# Altium project FlightController.PrjPcb
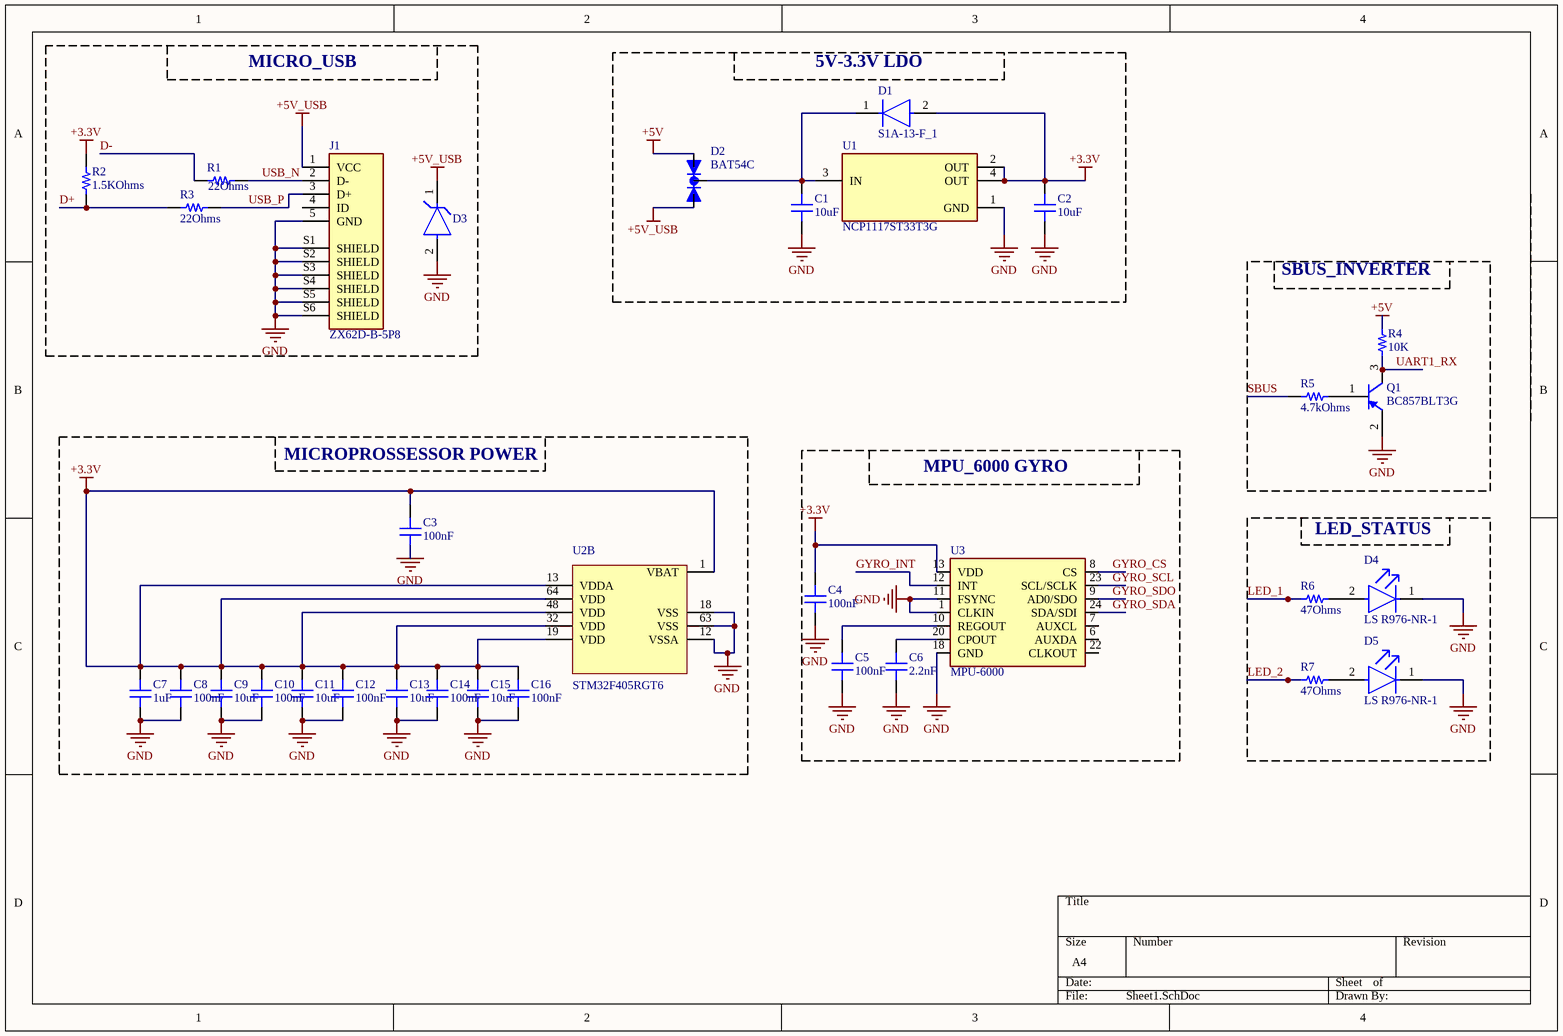
[diagram p0: Sheet1.SchDoc]
3 sheets, 45 parts. Net scope: global (net labels, ports and power ports of the same name join across sheets).
Board file: PCB1.PcbDoc
Sheets:
  Sheet1.SchDoc
  Sheet2.SchDoc
  blockdiagram.SchDoc

## Sheet Sheet1.SchDoc
size A4

### Parts
C1  10uF  [CAP-0603]
C2  10uF  [CAP-0603]
C3  100nF  [CAP-0603]
C4  100nF  [CAP-0603]
C5  100nF  [CAP-0603]
C6  2.2nF  [CAP-0603]
C7  1uF  [CAP-0603]
C8  100nF  [CAP-0603]
C9  10uF  [CAP-0603]
C10  100nF  [CAP-0603]
C11  10uF  [CAP-0603]
C12  100nF  [CAP-0603]
C13  10uF  [CAP-0603]
C14  100nF  [CAP-0603]
C15  10uF  [CAP-0603]
C16  100nF  [CAP-0603]
D1  S1A-13-F_1  [S1A-13-F]
D2  BAT54C  [SOT23-3]
D3  ESDA7P60-1U1M  [TVS-1610]  (value not drawn)
D4  LS R976-NR-1  [LS R976-NR-1]
D5  LS R976-NR-1  [LS R976-NR-1]
J1  ZX62D-B-5P8  [HRS_ZX62D-B-5P8]
Q1  BC857BLT3G  [SOT23-3]
R1  22Ohms  [RES-0603]
R2  1.5KOhms  [RES-0603]
R3  22Ohms  [RES-0603]
R4  10K  [RES-0603]
R5  4.7kOhms  [RES-0603]
R6  47Ohms  [RES-0603]
R7  47Ohms  [RES-0603]
U1  NCP1117ST33T3G  [SOT-223-4]
U2  STM32F405RGT6  [STMicroelectronics_LQFP64-5W_MFG]  (part B of 2)
U3  MPU-6000  [QFN-24-EP]

### Blocks framed on the sheet
MICRO_USB: D3 J1 R1-R3
5V-3.3V LDO: C1 C2 D1 D2 U1
SBUS_INVERTER: Q1 R4 R5
MICROPROSSESSOR POWER: C3 C7-C16 U2
MPU_6000 GYRO: C4-C6 U3
LED_STATUS: D4 D5 R6 R7

### Nets
+3.3V: C2.2 C3.2 C4.2 C7.2 C8.2 C9.2 C10.2 C11.2 C12.2 C13.2 C14.2 C15.2 C16.2 D1.2(A) R2.2 U1.2(OUT) U1.4(OUT) U2.1(VBAT) U2.13(VDDA) U2.19(VDD) U2.32(VDD) U2.48(VDD) U2.64(VDD) U3.13(VDD)
+5V: D2.1(A1) R4.2
+5V_USB: D2.2(A2) D3.1(C) J1.1(VCC)
GND: C1.1 C2.1 C3.1 C4.1 C5.2 C6.1 C7.1 C8.1 C9.1 C10.1 C11.1 C12.1 C13.1 C14.1 C15.1 C16.1 D3.2(A) D4.1(C) D5.1(C) J1.5(GND) J1.S1(SHIELD) J1.S2(SHIELD) J1.S3(SHIELD) J1.S4(SHIELD) J1.S5(SHIELD) J1.S6(SHIELD) Q1.2(E) U1.1(GND) U2.12(VSSA) U2.18(VSS) U2.63(VSS) U3.1(CLKIN) U3.11(FSYNC) U3.18(GND)
D+: R2.1 R3.1
D-: R1.1
GYRO_CS: U3.8(CS)
GYRO_INT: U3.12(INT)
GYRO_SCL: U3.23(SCL/SCLK)
GYRO_SDA: U3.24(SDA/SDI)
GYRO_SDO: U3.9(AD0/SDO)
LED_1: R6.2
LED_2: R7.2
SBUS: R5.1
UART1_RX: Q1.3(C) R4.1
USB_N: J1.2(D-) R1.2
USB_P: J1.3(D+) R3.2
NetC1_2: C1.2 D1.1(C) D2.3(C) U1.3(IN)
NetC5_1: C5.1 U3.10(REGOUT)
NetC6_2: C6.2 U3.20(CPOUT)
NetD4_2: D4.2(A) R6.1
NetD5_2: D5.2(A) R7.1
NetQ1_1: Q1.1(B) R5.2

Not connected (* = marked no-connect by the designer): J1 4(ID); U3 6(AUXDA) 7(AUXCL) 22(CLKOUT)

### Library data of the parts
C1 C2 C9 C11 C13 C15 = CC0603MRX5R7BB106: 10 µF ±20% 16V Ceramic Capacitor X5R 0603 (1608 Metric); Manufacturer: KEMET; Manufacturer Part Number: C0603C104K5RAC7411; Tolerance: 10%; Capacitance: 100nF; Dielectric: X7R; Voltage Rating (DC): 50V; Dissipation Factor: 2.5%; Supplier 1: Digi-Key; RoHS: Yes; Category: Ceramic Capacitors; Stock 1: 3300000; Pricing 1: 15000=0,01540, 30000=0,01463, 75000=0,01309, 105000=0,01059, 150000=0,01024, 375000=0,00963 (USD); Mount: Surface Mount; Case/Package: 0603; Case Code (Metric): 1608; Case Code (Imperial): 0603; Dielectric Material: Ceramic; Min Operating Temperature: -55°C; Max Operating Temperature: 125°C; Packaging: Tape and Reel; Package Quantity: 15000; Voltage Rating: 50V; Termination: SMD/SMT; Length: 1.6mm; Width: 0.031inch; Height: 0.8mm; Thickness: 0.035inch; Lead Pitch: 0.7mm; Depth: 0.8mm; Radiation Hardening: No; ComponentLink1URL: https://datasheet.ciiva.com/5424/kem-c1002-x7r-smd-5424426.pdf?src-supplier=Mouser; ComponentLink1Description: https://datasheet.ciiva.com/5424/kem-c1002-x7r-smd-5424426.pdf?src-supplier=Mouser; Supplier Part Number 1: 399-7374-2-ND; Supplier 2: Digi-Key; Stock 2: 3575; Pricing 2: 1=0,45000, 10=0,31500, 50=0,22080, 100=0,18930, 500=0,14194, 1000=0,11986 (USD); Weight: 7.1E-05oz; Lead Free: Lead Free; Halogen Free: Halogen Free; RoHS Compliant: Yes; ComponentLink2URL: http://www.mouser.com/ds/2/447/Yageo_UPY-GP_NP0_16V-to-50V_9-358835.pdf?src-supplier=Mouser; ComponentLink2Description: http://www.mouser.com/ds/2/447/Yageo_UPY-GP_NP0_16V-to-50V_9-358835.pdf?src-supplier=Mouser; ComponentLink3URL: http://www.yageo.com/documents/recent/UPY-GPHC_X5R_4V-to-50V_25.pdf?src-supplier=Digi-Key; ComponentLink3Description: http://www.yageo.com/documents/recent/UPY-GPHC_X5R_4V-to-50V_25.pdf?src-supplier=Digi-Key; Supplier Part Number 2: 311-1822-1-ND
C3-C5 C8 C10 C12 C14 C16 = C0603C104K5RAC7411: Cap Ceramic 0.1uF 50V X7R 10% SMD 0603 125°C Paper T/R 100nF; Manufacturer: KEMET; Dissipation Factor: 2.5%; Supplier 1: Digi-Key; Manufacturer Part Number: C0603C104K5RAC7411; RoHS: Yes; Category: Ceramic Capacitors; Stock 1: 3300000; Pricing 1: 15000=0,01540, 30000=0,01463, 75000=0,01309, 105000=0,01059, 150000=0,01024, 375000=0,00963 (USD); Mount: Surface Mount; Case/Package: 0603; Case Code (Metric): 1608; Case Code (Imperial): 0603; Dielectric Material: Ceramic; Min Operating Temperature: -55°C; Max Operating Temperature: 125°C; Tolerance: 10%; Capacitance: 100nF; Dielectric: X7R; Voltage Rating (DC): 50V; Packaging: Tape and Reel; Package Quantity: 15000; Voltage Rating: 50V; Termination: SMD/SMT; Length: 1.6mm; Width: 0.031inch; Height: 0.8mm; Thickness: 0.035inch; Lead Pitch: 0.7mm; Depth: 0.8mm; Radiation Hardening: No; ComponentLink1URL: https://datasheet.ciiva.com/5424/kem-c1002-x7r-smd-5424426.pdf?src-supplier=Mouser; ComponentLink1Description: https://datasheet.ciiva.com/5424/kem-c1002-x7r-smd-5424426.pdf?src-supplier=Mouser; Supplier Part Number 1: 399-7374-2-ND
C6 = 0603YC222KAT2A: 2200 pF ±10% 16V Ceramic Capacitor X7R 0603 (1608 Metric) 2.2nF; Manufacturer: KEMET; Manufacturer Part Number: C0603C104K5RAC7411; Capacitance: 100nF; Voltage Rating (DC): 50V; Dissipation Factor: 2.5%; Supplier 1: Digi-Key; RoHS: Yes; Category: Ceramic Capacitors; Stock 1: 3300000; Pricing 1: 15000=0,01540, 30000=0,01463, 75000=0,01309, 105000=0,01059, 150000=0,01024, 375000=0,00963 (USD); Mount: Surface Mount; Case/Package: 0603; Case Code (Metric): 1608; Case Code (Imperial): 0603; Dielectric Material: Ceramic; Min Operating Temperature: -55°C; Max Operating Temperature: 125°C; Tolerance: 10%; Dielectric: X7R; Packaging: Tape and Reel; Package Quantity: 15000; Voltage Rating: 50V; Termination: SMD/SMT; Length: 1.6mm; Width: 0.031inch; Height: 0.8mm; Thickness: 0.035inch; Lead Pitch: 0.7mm; Depth: 0.8mm; Radiation Hardening: No; ComponentLink1URL: https://datasheet.ciiva.com/5424/kem-c1002-x7r-smd-5424426.pdf?src-supplier=Mouser; ComponentLink1Description: https://datasheet.ciiva.com/5424/kem-c1002-x7r-smd-5424426.pdf?src-supplier=Mouser; Supplier Part Number 1: 399-7374-2-ND; Supplier 2: Digi-Key; Stock 2: 82908; Pricing 2: 1=0,10000, 10=0,06500, 50=0,03560, 100=0,02910, 500=0,02080, 1000=0,01634 (USD); Number of Pins: 2; Contact Plating: Tin,Matte; Series: -; Construction: Flat; REACH SVHC: No SVHC; Lead Free: Lead Free; RoHS Compliant: Yes; ComponentLink2URL: https://datasheet.ciiva.com/150/cx7r-150288.pdf?src-supplier=Digi-Key; ComponentLink2Description: https://datasheet.ciiva.com/150/cx7r-150288.pdf?src-supplier=Digi-Key; ComponentLink3URL: https://datasheet.ciiva.com/150/cx7r-150289.pdf?src-supplier=Digi-Key; ComponentLink3Description: https://datasheet.ciiva.com/150/cx7r-150289.pdf?src-supplier=Digi-Key; ComponentLink4URL: https://datasheet.ciiva.com/5412/cx7r-218113-5412506.pdf?src-supplier=Mouser; ComponentLink4Description: https://datasheet.ciiva.com/5412/cx7r-218113-5412506.pdf?src-supplier=Mouser; ComponentLink5URL: https://datasheet.ciiva.com/22682/1679506-22682859.pdf?src-supplier=Element14; ComponentLink5Description: https://datasheet.ciiva.com/22682/1679506-22682859.pdf?src-supplier=Element14; ComponentLink6URL: https://datasheet.ciiva.com/28546/1679506-28546235.pdf?src-supplier=Element14; ComponentLink6Description: https://datasheet.ciiva.com/28546/1679506-28546235.pdf?src-supplier=Element14; ComponentLink7URL: https://datasheet.ciiva.com/16199/cx7r-16199340.pdf?src-supplier=Future+Electronics; ComponentLink7Description: https://datasheet.ciiva.com/16199/cx7r-16199340.pdf?src-supplier=Future+Electronics; ComponentLink8URL: https://datasheet.ciiva.com/150/cx7r-150287.pdf?src-supplier=Digi-Key; ComponentLink8Description: https://datasheet.ciiva.com/150/cx7r-150287.pdf?src-supplier=Digi-Key; Supplier Part Number 2: 478-6210-1-ND
C7 = CC0603MRX5R7BB105: Cap Ceramic 1uF 16V X5R 20% Pad SMD 0603 85C Automotive T/R; Manufacturer: KEMET; Manufacturer Part Number: C0603C104K5RAC7411; Tolerance: 10%; Capacitance: 100nF; Dielectric: X7R; Voltage Rating (DC): 50V; Dissipation Factor: 2.5%; Supplier 1: Digi-Key; RoHS: Yes; Category: Ceramic Capacitors; Stock 1: 3300000; Pricing 1: 15000=0,01540, 30000=0,01463, 75000=0,01309, 105000=0,01059, 150000=0,01024, 375000=0,00963 (USD); Mount: Surface Mount; Case/Package: 0603; Case Code (Metric): 1608; Case Code (Imperial): 0603; Dielectric Material: Ceramic; Min Operating Temperature: -55°C; Max Operating Temperature: 125°C; Packaging: Tape and Reel; Package Quantity: 15000; Voltage Rating: 50V; Termination: SMD/SMT; Length: 1.6mm; Width: 0.031inch; Height: 0.8mm; Thickness: 0.035inch; Lead Pitch: 0.7mm; Depth: 0.8mm; Radiation Hardening: No; ComponentLink1URL: https://datasheet.ciiva.com/5424/kem-c1002-x7r-smd-5424426.pdf?src-supplier=Mouser; ComponentLink1Description: https://datasheet.ciiva.com/5424/kem-c1002-x7r-smd-5424426.pdf?src-supplier=Mouser; Supplier Part Number 1: 399-7374-2-ND; Supplier 2: Digi-Key; Stock 2: 3575; Pricing 2: 1=0,45000, 10=0,31500, 50=0,22080, 100=0,18930, 500=0,14194, 1000=0,11986 (USD); Weight: 7.1E-05oz; Lead Free: Lead Free; Halogen Free: Halogen Free; RoHS Compliant: Yes; ComponentLink2URL: http://www.mouser.com/ds/2/447/Yageo_UPY-GP_NP0_16V-to-50V_9-358835.pdf?src-supplier=Mouser; ComponentLink2Description: http://www.mouser.com/ds/2/447/Yageo_UPY-GP_NP0_16V-to-50V_9-358835.pdf?src-supplier=Mouser; ComponentLink3URL: http://www.yageo.com/documents/recent/UPY-GPHC_X5R_4V-to-50V_25.pdf?src-supplier=Digi-Key; ComponentLink3Description: http://www.yageo.com/documents/recent/UPY-GPHC_X5R_4V-to-50V_25.pdf?src-supplier=Digi-Key; Supplier Part Number 2: 311-1822-1-ND; Supplier 3: Digi-Key; Stock 3: 9457; Pricing 3: 1=0,11000, 10=0,08000, 50=0,04560, 100=0,03780, 500=0,02648, 1000=0,02191 (USD); Resistor Type: Ceramic; Series: CC; ComponentLink4URL: http://www.mouser.com/ds/2/447/UPY-GPHC_X5R_4V-to-50V_25-1131599.pdf?src-supplier=Mouser; ComponentLink4Description: http://www.mouser.com/ds/2/447/UPY-GPHC_X5R_4V-to-50V_25-1131599.pdf?src-supplier=Mouser; ComponentLink5URL: http://www.yageo.com/exep/pages/download/literatures/ProductSelectionGuide%202014_Final_2.pdf?src-supplier=Digi-Key; ComponentLink5Description: http://www.yageo.com/exep/pages/download/literatures/ProductSelectionGuide%202014_Final_2.pdf?src-supplier=Digi-Key; Supplier Part Number 3: 311-1821-1-ND
D1 = S1A-13-F_1: VR=50V IF=1A 10pF Trr=3us; Manufacturer: Diodes; Forward Current: 1A; Max Repetitive Reverse Voltage (Vrrm): 50V; Element Configuration: Single; Reverse Recovery Time: 3us; Peak Non-Repetitive Surge Current: 30A; Max Reverse Current: 5uA; Forward Voltage: 1.1V; Recovery Time: 1.8us; Polarity: Standard; Supplier 1: Digi-Key; Manufacturer Part Number: S1A-13-F; RoHS: Yes; Category: Rectifier Diodes; Stock 1: 971381; Pricing 1: 1=0,27000, 10=0,22300, 100=0,11850, 500=0,07796, 1000=0,05301, 2000=0,04782 (USD); Mount: Surface Mount; Case/Package: SMA; Number of Pins: 2; Weight: 0.002258oz; Min Operating Temperature: -65°C; Max Operating Temperature: 150°C; Packaging: Tape and Reel; Package Quantity: 5000; Max Surge Current: 30A; Reverse Voltage (DC): 50V; Average Rectified Current: 1A; Voltage Rating (DC): 50V; Current Rating: 1A; Capacitance: 10pF; Output Current: 1A; Max Reverse Voltage (DC): 50V; Series: -; Max Forward Surge Current (Ifsm): 30A; Termination: SMD/SMT; Length: 4.6mm; Width: 2.92mm; Height: 2.1mm; Radiation Hardening: No; Lead Free: Lead Free; RoHS Compliant: Yes; REACH SVHC: No SVHC; ComponentLink1URL: https://datasheet.ciiva.com/911/ds16003-911872.pdf?src-supplier=Digi-Key; ComponentLink1Description: https://datasheet.ciiva.com/911/ds16003-911872.pdf?src-supplier=Digi-Key; ComponentLink2URL: https://datasheet.ciiva.com/27052/1541520-27052419.pdf?src-supplier=Jameco; ComponentLink2Description: https://datasheet.ciiva.com/27052/1541520-27052419.pdf?src-supplier=Jameco; ComponentLink3URL: https://datasheet.ciiva.com/8301/ds16003-8301429.pdf?src-supplier=Avnet; ComponentLink3Description: https://datasheet.ciiva.com/8301/ds16003-8301429.pdf?src-supplier=Avnet; ComponentLink4URL: https://datasheet.ciiva.com/22695/1911706-22695830.pdf?src-supplier=Element14; ComponentLink4Description: https://datasheet.ciiva.com/22695/1911706-22695830.pdf?src-supplier=Element14; ComponentLink5URL: https://datasheet.ciiva.com/4453/ds16003-83672-4453580.pdf?src-supplier=Mouser; ComponentLink5Description: https://datasheet.ciiva.com/4453/ds16003-83672-4453580.pdf?src-supplier=Mouser; ComponentLink6URL: https://datasheet.ciiva.com/16199/ds16003-16199336.pdf?src-supplier=Future+Electronics; ComponentLink6Description: https://datasheet.ciiva.com/16199/ds16003-16199336.pdf?src-supplier=Future+Electronics; ComponentLink7URL: https://datasheet.ciiva.com/25953/ds16003-25953033.pdf?src-supplier=Avnet+Europe; ComponentLink7Description: https://datasheet.ciiva.com/25953/ds16003-25953033.pdf?src-supplier=Avnet+Europe; Supplier Part Number 1: S1A-FDICT-ND
D2 = BAT54C: Diode Array 1 Pair Common Cathode Schottky 30V 200mA Surface Mount TO-236-3, SC-59, SOT-23-3; MF: ON Semiconductor; Package: SOT-23-3 ON Semiconductor; Value: *; SnapEDA_Link: https://www.snapeda.com/parts/BAT54C/ON%20Semiconductor/view-part/1985258/?ref=snap; Availability: Unavailable; Price: None; MP: BAT54C
D3 = ESDA7P60-1U1M: ESDA Series 6.4 V 700 W SMT Uni-Directional TVS Diode - 1610; Manufacturer: STMicroelectronics; Number of Unidirectional Channels: 1; Reverse Standoff Voltage: 5V; Min Breakdown Voltage: 6.4V; Clamping Voltage: 11.6V; Peak Pulse Power: 700W; Power Line Protection: No; Polarity: Unidirectional; Max Breakdown Voltage: 7.2V; Peak Pulse Current: 60A; Supplier 1: Digi-Key; Manufacturer Part Number: ESDA7P60-1U1M; RoHS: Yes; Category: TVS Diodes; Stock 1: 12994; Pricing 1: 1=0,51000, 10=0,38400, 100=0,23910, 500=0,16360, 1000=0,12584, 2000=0,11326 (USD); Mount: Surface Mount; Case/Package: 1610; Number of Pins: 2; Min Operating Temperature: -55°C; Max Operating Temperature: 150°C; Packaging: Cut Tape; Resistor Type: Zener; REACH SVHC: No SVHC; RoHS Compliant: Yes; ComponentLink1URL: http://www.farnell.com/datasheets/2041290.pdf?src-supplier=Farnell; ComponentLink1Description: http://www.farnell.com/datasheets/2041290.pdf?src-supplier=Farnell; ComponentLink2URL: http://www.st.com/content/ccc/resource/technical/document/datasheet/44/e9/26/44/42/ee/4f/e5/DM00139972.pdf/files/DM00139972.pdf/jcr:content/translations/en.DM00139972.pdf?src-supplier=Digi-Key; ComponentLink2Description: http://www.st.com/content/ccc/resource/technical/document/datasheet/44/e9/26/44/42/ee/4f/e5/DM00139972.pdf/files/DM00139972.pdf/jcr:content/translations/en.DM00139972.pdf?src-supplier=Digi-Key; ComponentLink3URL: http://www.farnell.com/datasheets/2041290.pdf?src-supplier=Element14; ComponentLink3Description: http://www.farnell.com/datasheets/2041290.pdf?src-supplier=Element14; Supplier Part Number 1: 497-16253-1-ND
D4 D5 = LS R976-NR-1: Led SMT Red 0805 Tape; Manufacturer: Osram Opto; Lens Color: White; Forward Current: 25mA; Forward Voltage: 2.5V; Luminous Intensity: 180mcd; Viewing Angle: 160°; Lens Style: Flat,Diffused,Colorless,Rectangular; Test Current: 20mA; Dominant Wavelength: 633nm; Luminous Flux: 0.47lm; Number of Elements: 1; Reverse Voltage: 12V; Power Dissipation: 65mW; Lens Transparency: Diffused; Lens Size: 1.25mm; Supplier 1: Digi-Key; Manufacturer Part Number: LSR976-NR-1; RoHS: Yes; Category: LEDs; Stock 1: 165904; Pricing 1: 1=0,31000, 10=0,16700, 100=0,07750, 500=0,07152, 1000=0,05602, 2000=0,05483 (USD); Mount: Surface Mount; Case/Package: 0805; Number of Pins: 2; Color: Red; Case Code (Metric): 2012; Case Code (Imperial): 0805; Min Operating Temperature: -30°C; Max Operating Temperature: 85°C; Packaging: Tape and Reel; Number of LEDs: 1; Illumination Color: Red; Package Quantity: 16000; Series: CHIPLED 0805; Length: 2.1mm; Width: 1.25mm; Height: 0.9mm; Depth: 1.35mm; Radiation Hardening: No; RoHS Compliant: Yes; ComponentLink1URL: https://datasheet.ciiva.com/4688/o-ls-ly-r976-24152-4688435.pdf?src-supplier=Mouser; ComponentLink1Description: https://datasheet.ciiva.com/4688/o-ls-ly-r976-24152-4688435.pdf?src-supplier=Mouser; ComponentLink2URL: https://datasheet.ciiva.com/26920/getdatasheetpartid-568367-26920831.pdf?src-supplier=Verical; ComponentLink2Description: https://datasheet.ciiva.com/26920/getdatasheetpartid-568367-26920831.pdf?src-supplier=Verical; ComponentLink3URL: https://datasheet.ciiva.com/2112/00078896-0-2112782.pdf?src-supplier=Digi-Key; ComponentLink3Description: https://datasheet.ciiva.com/2112/00078896-0-2112782.pdf?src-supplier=Digi-Key; ComponentLink4URL: https://datasheet.ciiva.com/2112/00078896-0-2112781.pdf?src-supplier=Digi-Key; ComponentLink4Description: https://datasheet.ciiva.com/2112/00078896-0-2112781.pdf?src-supplier=Digi-Key; ComponentLink5URL: https://datasheet.ciiva.com/2112/00078896-0-2112783.pdf?src-supplier=Digi-Key; ComponentLink5Description: https://datasheet.ciiva.com/2112/00078896-0-2112783.pdf?src-supplier=Digi-Key; Supplier Part Number 1: 475-1278-1-ND
J1 = ZX62D-B-5P8: Conn Micro USB 2.0 Type B RCP 5 POS 0.65mm Solder RA SMD 5 Terminal 1 Port Embossed T/R; MF: Hirose; Value: *; Availability: Unavailable; SnapEDA_Link: https://www.snapeda.com/parts/ZX62D-B-5P8/Hirose%20Electric%20Co%20Ltd/view-part/46842/?ref=snap; Package: FakePackage u; MP: ZX62D-B-5P8; Price: None
Q1 = BC857BLT3G: General Purpose Transistor, PNP Silicon, 3-Pin SOT-23, Pb-Free, Tape and Reel; Manufacturer: On Semiconductor; fT Min (MHz): 100; IC Continuous (A): -0.1; Polarity: PNP; ComponentLink1Description: Manufacturer URL; ComponentLink2Description: Datasheet; DatasheetVersion: Rev. 13; Mounting Technology: Surface Mount; ComponentLink3URL: http://www.onsemi.cn/pub_link/Collateral/318-08.PDF; ComponentLink3Description: Package Specification; ComponentLink1URL: http://www.onsemi.com/; Packing: Tape and Reel; PackageVersion: Rev. AP, 11/2009; PartNumber: BC857BLT3G; PackageDescription: 3-Pin Small Outline Transistor, Body 2.92 x 1.3 mm, Pitch 0.95 mm; ComponentLink2URL: http://www.onsemi.cn/pub_link/Collateral/BC856ALT1-D.PDF; RoHS: TRUE; PackageReference: SOT-23-3-318-08
R1 R3 = RC0603JR-0722RL: 22 Ohms ±5% 0.1W, 1/10W Chip Resistor 0603 (1608 Metric) Moisture Resistant Thick Film; Manufacturer: Yageo; Manufacturer Part Number: RC0402JR-071K2L; Resistance: 1.2kR; Power Rating: 62.5mW; Voltage Rating: 50V; Temperature Coefficient: 100ppm/°C; Max Power Dissipation: 63mW; RoHS: Yes; Category: Chip SMD Resistors; Stock 1: 52843; Pricing 1: 1=0,10000, 10=0,01300, 100=0,00540, 1000=0,00244, 2500=0,00212, 5000=0,00175 (USD); Case/Package: 0402; Case Code (Imperial): 0402; Case Code (Metric): 1005; Size Code: 0402; Min Operating Temperature: -55°C; Max Operating Temperature: 155°C; Tolerance: 5%; Packaging: Tape and Reel; Termination: SMD/SMT; Resistor Type: Thick Film; Features: Moisture Resistant; Series: RC; Number of Terminations: 2; Resistance Tolerance: 5%; Construction: Rectangular; Length: 1mm; Width: 0.5mm; Height: 0.35mm; Depth: 0.5mm; REACH SVHC: No SVHC; Military Standard: Not; Lead Free: Lead Free; RoHS Compliant: Yes; ComponentLink1URL: https://datasheet.ciiva.com/7983/1018594-7983557.pdf?src-supplier=Element14; ComponentLink1Description: https://datasheet.ciiva.com/7983/1018594-7983557.pdf?src-supplier=Element14; ComponentLink2URL: https://datasheet.ciiva.com/12558/pyu-rc0402-51-rohs-l-6-r-8721-12558349.pdf?src-supplier=Mouser; ComponentLink2Description: https://datasheet.ciiva.com/12558/pyu-rc0402-51-rohs-l-6-r-8721-12558349.pdf?src-supplier=Mouser; ComponentLink3URL: https://datasheet.ciiva.com/7850/1018594-7850165.pdf?src-supplier=Element14; ComponentLink3Description: https://datasheet.ciiva.com/7850/1018594-7850165.pdf?src-supplier=Element14; ComponentLink4URL: https://datasheet.ciiva.com/15189/getdatasheetpartid-325064-15189548.pdf?src-supplier=Verical; ComponentLink4Description: https://datasheet.ciiva.com/15189/getdatasheetpartid-325064-15189548.pdf?src-supplier=Verical; ComponentLink5URL: https://datasheet.ciiva.com/17068/pyu-rc0402-51-rohs-l-6-r-17068326.pdf?src-supplier=Future+Electronics; ComponentLink5Description: https://datasheet.ciiva.com/17068/pyu-rc0402-51-rohs-l-6-r-17068326.pdf?src-supplier=Future+Electronics; Stock 2: 41751; Pricing 2: 1=0,10000, 10=0,02000, 100=0,00800, 1000=0,00360, 2500=0,00312, 5000=0,00258 (USD); Number of Pins: 2; Voltage Rating (DC): 50V; Package Quantity: 1; ComponentLink6URL: https://datasheet.ciiva.com/2452/pyu-r-int-thick-7-2452873.pdf?src-supplier=Digi-Key; ComponentLink6Description: https://datasheet.ciiva.com/2452/pyu-r-int-thick-7-2452873.pdf?src-supplier=Digi-Key; ComponentLink7URL: https://datasheet.ciiva.com/2452/pyu-r-int-thick-7-2452874.pdf?src-supplier=Digi-Key; ComponentLink7Description: https://datasheet.ciiva.com/2452/pyu-r-int-thick-7-2452874.pdf?src-supplier=Digi-Key; ComponentLink8URL: https://datasheet.ciiva.com/2452/pyu-r-int-thick-7-2452872.pdf?src-supplier=Digi-Key; ComponentLink8Description: https://datasheet.ciiva.com/2452/pyu-r-int-thick-7-2452872.pdf?src-supplier=Digi-Key; ComponentLink9URL: https://datasheet.ciiva.com/7746/443971-7746456.pdf?src-supplier=Element14; ComponentLink9Description: https://datasheet.ciiva.com/7746/443971-7746456.pdf?src-supplier=Element14; ComponentLink10URL: https://datasheet.ciiva.com/7746/443971-7746455.pdf?src-supplier=Element14; ComponentLink10Description: https://datasheet.ciiva.com/7746/443971-7746455.pdf?src-supplier=Element14; Supplier 1: Digi-Key; Supplier Part Number 1: 311-1.2KGRCT-ND; Supplier 2: Digi-Key; Contact Plating: Tin,Lead,Matte; Radiation Hardening: No; ComponentLink11URL: https://datasheet.ciiva.com/22643/443971-22643423.pdf?src-supplier=Element14; ComponentLink11Description: https://datasheet.ciiva.com/22643/443971-22643423.pdf?src-supplier=Element14; Supplier Part Number 2: 13-RC0603JR-131KLCT-ND; Supplier 3: Digi-Key; Stock 3: 810575; Pricing 3: 1=0,10000, 10=0,02000, 100=0,00800, 1000=0,00360, 2500=0,00312 (USD); ComponentLink12URL: https://datasheet.ciiva.com/46394/443971-46394999.pdf?src-supplier=Element14; ComponentLink12Description: https://datasheet.ciiva.com/46394/443971-46394999.pdf?src-supplier=Element14; ComponentLink13URL: https://datasheet.ciiva.com/7746/443971-7746471.pdf?src-supplier=Element14; ComponentLink13Description: https://datasheet.ciiva.com/7746/443971-7746471.pdf?src-supplier=Element14; ComponentLink14URL: https://datasheet.ciiva.com/7746/443971-7746472.pdf?src-supplier=Element14; ComponentLink14Description: https://datasheet.ciiva.com/7746/443971-7746472.pdf?src-supplier=Element14; ComponentLink15URL: https://datasheet.ciiva.com/15189/getdatasheetpartid-493085-15189862.pdf?src-supplier=Verical; ComponentLink15Description: https://datasheet.ciiva.com/15189/getdatasheetpartid-493085-15189862.pdf?src-supplier=Verical; Supplier Part Number 3: 311-22GRCT-ND
R2 = RC0603FR-071K5L: 1500Ω ± 1.00% 0.1W ± 100ppm/℃ 0603; Manufacturer: Yageo; Manufacturer Part Number: RC0603FR-0710KL; Tolerance: 1%; Resistance: 10kR; Temperature Coefficient: 100ppm/°C; Voltage Rating (DC): 50V; Power Rating: 100mW; Voltage Rating: 75V; Supplier 1: Digi-Key; RoHS: Yes; Category: Chip SMD Resistors; Stock 1: 28996893; Pricing 1: 1=0,10000, 10=0,02400, 100=0,00970, 1000=0,00436, 2500=0,00378 (USD); Case/Package: 0603; Number of Pins: 2; Case Code (Imperial): 0603; Case Code (Metric): 1608; Weight: 7.1E-05oz; Size Code: 0603; Min Operating Temperature: -55°C; Max Operating Temperature: 155°C; Resistor Type: Thick Film; Packaging: Tape and Reel; Termination: SMD/SMT; Features: Moisture Resistant; Series: RC; Max Power Dissipation: 100mW; Number of Terminations: 2; Resistance Tolerance: 1%; Construction: Rectangular; Length: 1.6mm; Width: 0.8mm; Height: 0.45mm; Depth: 0.8mm; Lead Pitch: 0.3mm; REACH SVHC: Unknown; Lead Free: Lead Free; Military Standard: Not; RoHS Compliant: Yes; ComponentLink1URL: https://datasheet.ciiva.com/7660/38590-7660789.pdf?src-supplier=Element14; ComponentLink1Description: https://datasheet.ciiva.com/7660/38590-7660789.pdf?src-supplier=Element14; ComponentLink2URL: https://datasheet.ciiva.com/7983/443971-7983596.pdf?src-supplier=Element14; ComponentLink2Description: https://datasheet.ciiva.com/7983/443971-7983596.pdf?src-supplier=Element14; ComponentLink3URL: https://datasheet.ciiva.com/22747/443971-22747519.pdf?src-supplier=Element14; ComponentLink3Description: https://datasheet.ciiva.com/22747/443971-22747519.pdf?src-supplier=Element14; ComponentLink4URL: https://datasheet.ciiva.com/46440/1868787-46440891.pdf?src-supplier=Element14; ComponentLink4Description: https://datasheet.ciiva.com/46440/1868787-46440891.pdf?src-supplier=Element14; ComponentLink5URL: https://datasheet.ciiva.com/7746/1738695-7746239.pdf?src-supplier=Element14; ComponentLink5Description: https://datasheet.ciiva.com/7746/1738695-7746239.pdf?src-supplier=Element14; ComponentLink6URL: https://datasheet.ciiva.com/15189/getdatasheetpartid-409289-15189591.pdf?src-supplier=Verical; ComponentLink6Description: https://datasheet.ciiva.com/15189/getdatasheetpartid-409289-15189591.pdf?src-supplier=Verical; Supplier Part Number 1: 311-10.0KHRCT-ND; Supplier 2: Digi-Key; Stock 2: 3859269; Pricing 2: 1=0,10000, 10=0,02400, 100=0,00970, 1000=0,00436, 2500=0,00378 (USD); Package Quantity: 1
R4 = RC0603FR-0710KL: 10 kOhms ±1% 0.1W, 1/10W Chip Resistor 0603 (1608 Metric) Moisture Resistant Thick Film; Manufacturer: Yageo; Resistance: 10kR; Temperature Coefficient: 100ppm/°C; Voltage Rating (DC): 50V; Power Rating: 100mW; Voltage Rating: 75V; Supplier 1: Digi-Key; Manufacturer Part Number: RC0603FR-0710KL; RoHS: Yes; Category: Chip SMD Resistors; Stock 1: 28996893; Pricing 1: 1=0,10000, 10=0,02400, 100=0,00970, 1000=0,00436, 2500=0,00378 (USD); Case/Package: 0603; Number of Pins: 2; Case Code (Imperial): 0603; Case Code (Metric): 1608; Weight: 7.1E-05oz; Size Code: 0603; Min Operating Temperature: -55°C; Max Operating Temperature: 155°C; Tolerance: 1%; Resistor Type: Thick Film; Packaging: Tape and Reel; Termination: SMD/SMT; Features: Moisture Resistant; Series: RC; Max Power Dissipation: 100mW; Number of Terminations: 2; Resistance Tolerance: 1%; Construction: Rectangular; Length: 1.6mm; Width: 0.8mm; Height: 0.45mm; Depth: 0.8mm; Lead Pitch: 0.3mm; REACH SVHC: Unknown; Lead Free: Lead Free; Military Standard: Not; RoHS Compliant: Yes; ComponentLink1URL: https://datasheet.ciiva.com/7660/38590-7660789.pdf?src-supplier=Element14; ComponentLink1Description: https://datasheet.ciiva.com/7660/38590-7660789.pdf?src-supplier=Element14; ComponentLink2URL: https://datasheet.ciiva.com/7983/443971-7983596.pdf?src-supplier=Element14; ComponentLink2Description: https://datasheet.ciiva.com/7983/443971-7983596.pdf?src-supplier=Element14; ComponentLink3URL: https://datasheet.ciiva.com/22747/443971-22747519.pdf?src-supplier=Element14; ComponentLink3Description: https://datasheet.ciiva.com/22747/443971-22747519.pdf?src-supplier=Element14; ComponentLink4URL: https://datasheet.ciiva.com/46440/1868787-46440891.pdf?src-supplier=Element14; ComponentLink4Description: https://datasheet.ciiva.com/46440/1868787-46440891.pdf?src-supplier=Element14; ComponentLink5URL: https://datasheet.ciiva.com/7746/1738695-7746239.pdf?src-supplier=Element14; ComponentLink5Description: https://datasheet.ciiva.com/7746/1738695-7746239.pdf?src-supplier=Element14; ComponentLink6URL: https://datasheet.ciiva.com/15189/getdatasheetpartid-409289-15189591.pdf?src-supplier=Verical; ComponentLink6Description: https://datasheet.ciiva.com/15189/getdatasheetpartid-409289-15189591.pdf?src-supplier=Verical; Supplier Part Number 1: 311-10.0KHRCT-ND
R5 = RC0603FR-074K7L: 4.7 kOhms ±1% 0.1W, 1/10W Chip Resistor 0603 (1608 Metric) Moisture Resistant Thick Film; Manufacturer: Yageo; Manufacturer Part Number: RC0603FR-0710KL; Resistance: 10kR; Temperature Coefficient: 100ppm/°C; Voltage Rating (DC): 50V; Power Rating: 100mW; Voltage Rating: 75V; Supplier 1: Digi-Key; RoHS: Yes; Category: Chip SMD Resistors; Stock 1: 28996893; Pricing 1: 1=0,10000, 10=0,02400, 100=0,00970, 1000=0,00436, 2500=0,00378 (USD); Case/Package: 0603; Number of Pins: 2; Case Code (Imperial): 0603; Case Code (Metric): 1608; Weight: 7.1E-05oz; Size Code: 0603; Min Operating Temperature: -55°C; Max Operating Temperature: 155°C; Tolerance: 1%; Resistor Type: Thick Film; Packaging: Tape and Reel; Termination: SMD/SMT; Features: Moisture Resistant; Series: RC; Max Power Dissipation: 100mW; Number of Terminations: 2; Resistance Tolerance: 1%; Construction: Rectangular; Length: 1.6mm; Width: 0.8mm; Height: 0.45mm; Depth: 0.8mm; Lead Pitch: 0.3mm; REACH SVHC: Unknown; Lead Free: Lead Free; Military Standard: Not; RoHS Compliant: Yes; ComponentLink1URL: https://datasheet.ciiva.com/7660/38590-7660789.pdf?src-supplier=Element14; ComponentLink1Description: https://datasheet.ciiva.com/7660/38590-7660789.pdf?src-supplier=Element14; ComponentLink2URL: https://datasheet.ciiva.com/7983/443971-7983596.pdf?src-supplier=Element14; ComponentLink2Description: https://datasheet.ciiva.com/7983/443971-7983596.pdf?src-supplier=Element14; ComponentLink3URL: https://datasheet.ciiva.com/22747/443971-22747519.pdf?src-supplier=Element14; ComponentLink3Description: https://datasheet.ciiva.com/22747/443971-22747519.pdf?src-supplier=Element14; ComponentLink4URL: https://datasheet.ciiva.com/46440/1868787-46440891.pdf?src-supplier=Element14; ComponentLink4Description: https://datasheet.ciiva.com/46440/1868787-46440891.pdf?src-supplier=Element14; ComponentLink5URL: https://datasheet.ciiva.com/7746/1738695-7746239.pdf?src-supplier=Element14; ComponentLink5Description: https://datasheet.ciiva.com/7746/1738695-7746239.pdf?src-supplier=Element14; ComponentLink6URL: https://datasheet.ciiva.com/15189/getdatasheetpartid-409289-15189591.pdf?src-supplier=Verical; ComponentLink6Description: https://datasheet.ciiva.com/15189/getdatasheetpartid-409289-15189591.pdf?src-supplier=Verical; Supplier Part Number 1: 311-10.0KHRCT-ND; Supplier 2: Digi-Key; Stock 2: 20570870; Pricing 2: 1=0,10000, 10=0,02400, 100=0,00970, 1000=0,00436, 2500=0,00378 (USD); ComponentLink7URL: https://datasheet.ciiva.com/15189/getdatasheetpartid-422754-15189760.pdf?src-supplier=Verical; ComponentLink7Description: https://datasheet.ciiva.com/15189/getdatasheetpartid-422754-15189760.pdf?src-supplier=Verical; ComponentLink8URL: https://datasheet.ciiva.com/7660/38590-7660794.pdf?src-supplier=Element14; ComponentLink8Description: https://datasheet.ciiva.com/7660/38590-7660794.pdf?src-supplier=Element14; ComponentLink9URL: https://datasheet.ciiva.com/22747/443971-22747528.pdf?src-supplier=Element14; ComponentLink9Description: https://datasheet.ciiva.com/22747/443971-22747528.pdf?src-supplier=Element14; ComponentLink10URL: https://datasheet.ciiva.com/46440/1868787-46440909.pdf?src-supplier=Element14; ComponentLink10Description: https://datasheet.ciiva.com/46440/1868787-46440909.pdf?src-supplier=Element14; ComponentLink11URL: https://datasheet.ciiva.com/7746/1868787-7746365.pdf?src-supplier=Element14; ComponentLink11Description: https://datasheet.ciiva.com/7746/1868787-7746365.pdf?src-supplier=Element14; ComponentLink12URL: https://datasheet.ciiva.com/7746/1738695-7746366.pdf?src-supplier=Element14; ComponentLink12Description: https://datasheet.ciiva.com/7746/1738695-7746366.pdf?src-supplier=Element14; Supplier Part Number 2: 311-4.70KHRCT-ND
R6 R7 = RC0603JR-0722RL_1: 47Ω ± 5.00% 0.1W ± 100ppm/℃ 0603; Manufacturer: Yageo; Manufacturer Part Number: RC0402JR-071K2L; Tolerance: 5%; Resistance: 47R; Power Rating: 62.5mW; Voltage Rating: 50V; Temperature Coefficient: 100ppm/°C; Max Power Dissipation: 63mW; RoHS: Yes; Category: Chip SMD Resistors; Stock 1: 52843; Pricing 1: 1=0,10000, 10=0,01300, 100=0,00540, 1000=0,00244, 2500=0,00212, 5000=0,00175 (USD); Case/Package: 0402; Case Code (Imperial): 0402; Case Code (Metric): 1005; Size Code: 0402; Min Operating Temperature: -55°C; Max Operating Temperature: 155°C; Packaging: Tape and Reel; Termination: SMD/SMT; Resistor Type: Thick Film; Features: Moisture Resistant; Series: RC; Number of Terminations: 2; Resistance Tolerance: 5%; Construction: Rectangular; Length: 1mm; Width: 0.5mm; Height: 0.35mm; Depth: 0.5mm; REACH SVHC: No SVHC; Military Standard: Not; Lead Free: Lead Free; RoHS Compliant: Yes; ComponentLink1URL: https://datasheet.ciiva.com/7983/1018594-7983557.pdf?src-supplier=Element14; ComponentLink1Description: https://datasheet.ciiva.com/7983/1018594-7983557.pdf?src-supplier=Element14; ComponentLink2URL: https://datasheet.ciiva.com/12558/pyu-rc0402-51-rohs-l-6-r-8721-12558349.pdf?src-supplier=Mouser; ComponentLink2Description: https://datasheet.ciiva.com/12558/pyu-rc0402-51-rohs-l-6-r-8721-12558349.pdf?src-supplier=Mouser; ComponentLink3URL: https://datasheet.ciiva.com/7850/1018594-7850165.pdf?src-supplier=Element14; ComponentLink3Description: https://datasheet.ciiva.com/7850/1018594-7850165.pdf?src-supplier=Element14; ComponentLink4URL: https://datasheet.ciiva.com/15189/getdatasheetpartid-325064-15189548.pdf?src-supplier=Verical; ComponentLink4Description: https://datasheet.ciiva.com/15189/getdatasheetpartid-325064-15189548.pdf?src-supplier=Verical; ComponentLink5URL: https://datasheet.ciiva.com/17068/pyu-rc0402-51-rohs-l-6-r-17068326.pdf?src-supplier=Future+Electronics; ComponentLink5Description: https://datasheet.ciiva.com/17068/pyu-rc0402-51-rohs-l-6-r-17068326.pdf?src-supplier=Future+Electronics; Stock 2: 41751; Pricing 2: 1=0,10000, 10=0,02000, 100=0,00800, 1000=0,00360, 2500=0,00312, 5000=0,00258 (USD); Number of Pins: 2; Voltage Rating (DC): 50V; Package Quantity: 1; ComponentLink6URL: https://datasheet.ciiva.com/2452/pyu-r-int-thick-7-2452873.pdf?src-supplier=Digi-Key; ComponentLink6Description: https://datasheet.ciiva.com/2452/pyu-r-int-thick-7-2452873.pdf?src-supplier=Digi-Key; ComponentLink7URL: https://datasheet.ciiva.com/2452/pyu-r-int-thick-7-2452874.pdf?src-supplier=Digi-Key; ComponentLink7Description: https://datasheet.ciiva.com/2452/pyu-r-int-thick-7-2452874.pdf?src-supplier=Digi-Key; ComponentLink8URL: https://datasheet.ciiva.com/2452/pyu-r-int-thick-7-2452872.pdf?src-supplier=Digi-Key; ComponentLink8Description: https://datasheet.ciiva.com/2452/pyu-r-int-thick-7-2452872.pdf?src-supplier=Digi-Key; ComponentLink9URL: https://datasheet.ciiva.com/7746/443971-7746456.pdf?src-supplier=Element14; ComponentLink9Description: https://datasheet.ciiva.com/7746/443971-7746456.pdf?src-supplier=Element14; ComponentLink10URL: https://datasheet.ciiva.com/7746/443971-7746455.pdf?src-supplier=Element14; ComponentLink10Description: https://datasheet.ciiva.com/7746/443971-7746455.pdf?src-supplier=Element14; Supplier 1: Digi-Key; Supplier Part Number 1: 311-1.2KGRCT-ND; Supplier 2: Digi-Key; Contact Plating: Tin,Lead,Matte; Radiation Hardening: No; ComponentLink11URL: https://datasheet.ciiva.com/22643/443971-22643423.pdf?src-supplier=Element14; ComponentLink11Description: https://datasheet.ciiva.com/22643/443971-22643423.pdf?src-supplier=Element14; Supplier Part Number 2: 13-RC0603JR-131KLCT-ND; Supplier 3: Digi-Key; Stock 3: 810575; Pricing 3: 1=0,10000, 10=0,02000, 100=0,00800, 1000=0,00360, 2500=0,00312 (USD); ComponentLink12URL: https://datasheet.ciiva.com/46394/443971-46394999.pdf?src-supplier=Element14; ComponentLink12Description: https://datasheet.ciiva.com/46394/443971-46394999.pdf?src-supplier=Element14; ComponentLink13URL: https://datasheet.ciiva.com/7746/443971-7746471.pdf?src-supplier=Element14; ComponentLink13Description: https://datasheet.ciiva.com/7746/443971-7746471.pdf?src-supplier=Element14; ComponentLink14URL: https://datasheet.ciiva.com/7746/443971-7746472.pdf?src-supplier=Element14; ComponentLink14Description: https://datasheet.ciiva.com/7746/443971-7746472.pdf?src-supplier=Element14; ComponentLink15URL: https://datasheet.ciiva.com/15189/getdatasheetpartid-493085-15189862.pdf?src-supplier=Verical; ComponentLink15Description: https://datasheet.ciiva.com/15189/getdatasheetpartid-493085-15189862.pdf?src-supplier=Verical; Supplier Part Number 3: 311-22GRCT-ND; Supplier 4: Digi-Key; Stock 4: 380901; Pricing 4: 1=0,10000, 10=0,02000, 100=0,00800, 1000=0,00360, 2500=0,00312 (USD); ComponentLink16URL: https://datasheet.ciiva.com/46395/443971-46395079.pdf?src-supplier=Element14; ComponentLink16Description: https://datasheet.ciiva.com/46395/443971-46395079.pdf?src-supplier=Element14; ComponentLink17URL: https://datasheet.ciiva.com/7746/443971-7746511.pdf?src-supplier=Element14; ComponentLink17Description: https://datasheet.ciiva.com/7746/443971-7746511.pdf?src-supplier=Element14; Supplier Part Number 4: 311-47GRDKR-ND
U1 = NCP1117ST33T3G: Linear Voltage Regulator IC 1 Output 1A SOT-223; MF: ON Semiconductor; Value: *; SnapEDA_Link: https://www.snapeda.com/parts/NCP1117ST33T3G/ON%20Semiconductor/view-part/802519/?ref=snap; MP: NCP1117ST33T3G; Availability: Unavailable; Price: None; Package: TO-261-4 HTC Korea
U2 = STM32F405RGT6: ARMÂ® CortexÂ®-M4 STM32F4 Microcontroller IC 32-Bit 168MHz 1MB _1M x 8_ FLASH 64-LQFP _10x10_; MF: STMicroelectronics; Package: LQFP-64 STMicroelectronics; Digi-Key_Purchase_URL: https://www.digikey.com/product-detail/en/stmicroelectronics/STM32F405RGT6/497-11767-ND/2754208?utm_source=snapeda&utm_medium=aggregator&utm_campaign=symbol; Value: *; MP: STM32F405RGT6; SnapEDA_Link: https://www.snapeda.com/parts/STM32F405RGT6/STMicroelectronics/view-part/105502/?ref=snap; Digi-Key_Part_Number: 497-11767-ND
U3 = MPU-6000: Accelerometer, Gyroscope, 6 Axis Sensor I2C, SPI Output; MF: TDK InvenSense; Value: *; SnapEDA_Link: https://www.snapeda.com/parts/MPU-6000/TDK%20InvenSense/view-part/43945/?ref=snap; Price: None; Availability: Unavailable; Package: QFN-24 TDK InvenSense; MP: MPU-6000

## Sheet Sheet2.SchDoc
size A4
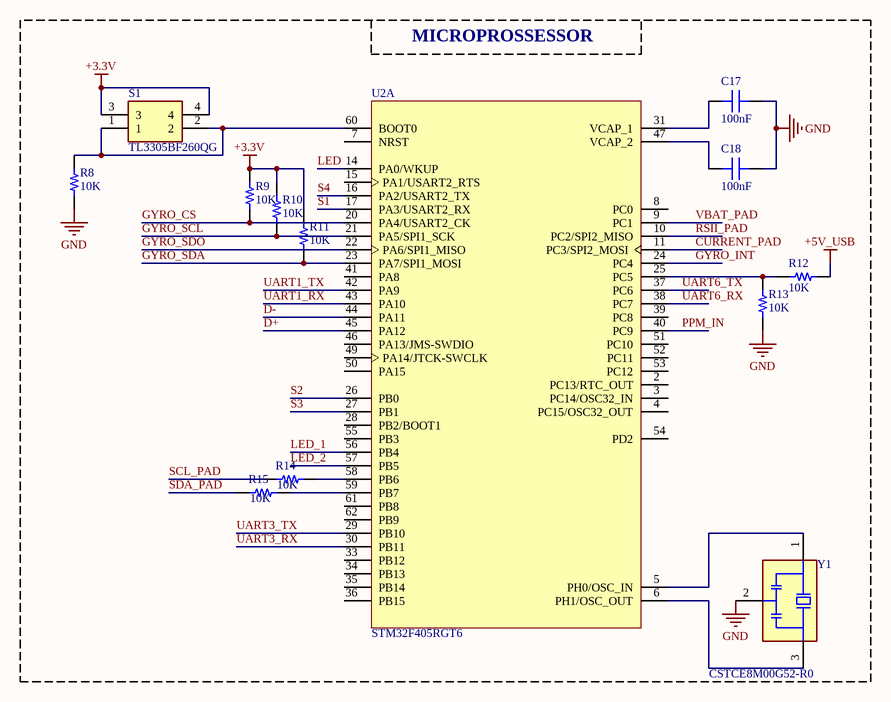
[diagram p1: Sheet2.SchDoc]

### Parts
C17  100nF  [CAP-0603]
C18  100nF  [CAP-0603]
R8  10K  [RES-0603]
R9  10K  [RES-0603]
R10  10K  [RES-0603]
R11  10K  [RES-0603]
R12  10K  [RES-0603]
R13  10K  [RES-0603]
R14  10K  [RES-0603]
R15  10K  [RES-0603]
S1  TL3305BF260QG  [TL3305BF260QG]
U2  STM32F405RGT6  [STMicroelectronics_LQFP64-5W_MFG]  (part A of 2)
Y1  CSTCE8M00G52-R0  [OSC_CSTCE8M00G52-R0]

### Blocks framed on the sheet
MICROPROSSESSOR: C17 C18 R8-R15 S1 U2 Y1

### Nets
+3.3V: R9.2 R10.2 R11.2 S1.3 S1.4
+5V_USB: R12.2
GND: C17.1 C18.1 R8.1 R13.1 Y1.2(GND)
CURRENT_PAD: U2.11(PC3/SPI2_MOSI)
D+: U2.45(PA12)
D-: U2.44(PA11)
GYRO_CS: R9.1 U2.20(PA4/USART2_CK)
GYRO_INT: U2.24(PC4)
GYRO_SCL: R10.1 U2.21(PA5/SPI1_SCK)
GYRO_SDA: R11.1 U2.23(PA7/SPI1_MOSI)
GYRO_SDO: U2.22(PA6/SPI1_MISO)
LED: U2.14(PA0/WKUP)
LED_1: U2.56(PB4)
LED_2: U2.57(PB5)
PPM_IN: U2.40(PC9)
RSII_PAD: U2.10(PC2/SPI2_MISO)
S1: U2.17(PA3/USART2_RX)
S2: U2.26(PB0)
S3: U2.27(PB1)
S4: U2.16(PA2/USART2_TX)
SCL_PAD: R14.1
SDA_PAD: R15.1
UART1_RX: U2.43(PA10)
UART1_TX: U2.42(PA9)
UART3_RX: U2.30(PB11)
UART3_TX: U2.29(PB10)
UART6_RX: U2.38(PC7)
UART6_TX: U2.37(PC6)
VBAT_PAD: U2.9(PC1)
NetC17_2: C17.2 U2.31(VCAP_1)
NetC18_2: C18.2 U2.47(VCAP_2)
NetR8_2: R8.2 S1.1 S1.2 U2.60(BOOT0)
NetR12_1: R12.1 R13.2 U2.25(PC5)
NetR14_2: R14.2 U2.58(PB6)
NetR15_2: R15.2 U2.59(PB7)
NetU2_5: U2.5(PH0/OSC_IN) Y1.1(IN)
NetU2_6: U2.6(PH1/OSC_OUT) Y1.3(OUT)

Not connected (* = marked no-connect by the designer): U2 2(PC13/RTC_OUT) 3(PC14/OSC32_IN) 4(PC15/OSC32_OUT) 7(NRST) 8(PC0) 15(PA1/USART2_RTS) 28(PB2/BOOT1) 33(PB12) 34(PB13) 35(PB14) 36(PB15) 39(PC8) 41(PA8) 46(PA13/JMS-SWDIO) 49(PA14/JTCK-SWCLK) 50(PA15) 51(PC10) 52(PC11) 53(PC12) 54(PD2) 55(PB3) 61(PB8) 62(PB9)

### Library data of the parts
C17 C18 = C0603C104K5RAC7411: as C3 on sheet Sheet1; Supplier 1: Digi-Key; Manufacturer Part Number: C0603C104K5RAC7411; RoHS: Yes; Category: Ceramic Capacitors; Stock 1: 3300000; Pricing 1: 15000=0,01540, 30000=0,01463, 75000=0,01309, 105000=0,01059, 150000=0,01024, 375000=0,00963 (USD); Mount: Surface Mount; Case/Package: 0603; Case Code (Metric): 1608; Case Code (Imperial): 0603; Dielectric Material: Ceramic; Min Operating Temperature: -55°C; Max Operating Temperature: 125°C; Tolerance: 10%; Capacitance: 100nF; Dielectric: X7R; Voltage Rating (DC): 50V; Packaging: Tape and Reel; Package Quantity: 15000; Voltage Rating: 50V; Termination: SMD/SMT; Length: 1.6mm; Width: 0.031inch; Height: 0.8mm; Thickness: 0.035inch; Lead Pitch: 0.7mm; Depth: 0.8mm; Radiation Hardening: No; ComponentLink1URL: https://datasheet.ciiva.com/5424/kem-c1002-x7r-smd-5424426.pdf?src-supplier=Mouser; ComponentLink1Description: https://datasheet.ciiva.com/5424/kem-c1002-x7r-smd-5424426.pdf?src-supplier=Mouser; Supplier Part Number 1: 399-7374-2-ND
R8-R15 = RC0603FR-0710KL: as R4 on sheet Sheet1; Supplier 1: Digi-Key; Manufacturer Part Number: RC0603FR-0710KL; RoHS: Yes; Category: Chip SMD Resistors; Stock 1: 28996893; Pricing 1: 1=0,10000, 10=0,02400, 100=0,00970, 1000=0,00436, 2500=0,00378 (USD); Case/Package: 0603; Number of Pins: 2; Case Code (Imperial): 0603; Case Code (Metric): 1608; Weight: 7.1E-05oz; Size Code: 0603; Min Operating Temperature: -55°C; Max Operating Temperature: 155°C; Tolerance: 1%; Resistor Type: Thick Film; Packaging: Tape and Reel; Termination: SMD/SMT; Features: Moisture Resistant; Series: RC; Max Power Dissipation: 100mW; Number of Terminations: 2; Resistance Tolerance: 1%; Construction: Rectangular; Length: 1.6mm; Width: 0.8mm; Height: 0.45mm; Depth: 0.8mm; Lead Pitch: 0.3mm; REACH SVHC: Unknown; Lead Free: Lead Free; Military Standard: Not; RoHS Compliant: Yes; ComponentLink1URL: https://datasheet.ciiva.com/7660/38590-7660789.pdf?src-supplier=Element14; ComponentLink1Description: https://datasheet.ciiva.com/7660/38590-7660789.pdf?src-supplier=Element14; ComponentLink2URL: https://datasheet.ciiva.com/7983/443971-7983596.pdf?src-supplier=Element14; ComponentLink2Description: https://datasheet.ciiva.com/7983/443971-7983596.pdf?src-supplier=Element14; ComponentLink3URL: https://datasheet.ciiva.com/22747/443971-22747519.pdf?src-supplier=Element14; ComponentLink3Description: https://datasheet.ciiva.com/22747/443971-22747519.pdf?src-supplier=Element14; ComponentLink4URL: https://datasheet.ciiva.com/46440/1868787-46440891.pdf?src-supplier=Element14; ComponentLink4Description: https://datasheet.ciiva.com/46440/1868787-46440891.pdf?src-supplier=Element14; ComponentLink5URL: https://datasheet.ciiva.com/7746/1738695-7746239.pdf?src-supplier=Element14; ComponentLink5Description: https://datasheet.ciiva.com/7746/1738695-7746239.pdf?src-supplier=Element14; ComponentLink6URL: https://datasheet.ciiva.com/15189/getdatasheetpartid-409289-15189591.pdf?src-supplier=Verical; ComponentLink6Description: https://datasheet.ciiva.com/15189/getdatasheetpartid-409289-15189591.pdf?src-supplier=Verical; Supplier Part Number 1: 311-10.0KHRCT-ND
S1 = TL3305BF260QG: Switch; Manufacturer_Name: E-Switch; Datasheet Link: https://sten-eswitch-13110800-production.s3.amazonaws.com/system/asset/product_line/data_sheet/213/TL3305.pdf; Height: 5mm; Manufacturer_Part_Number: TL3305BF260QG; Mouser Part Number: 612-TL3305BF260QG; Mouser Price/Stock: https://www.mouser.co.uk/ProductDetail/E-Switch/TL3305BF260QG?qs=UrFqKgNWc7Tq35XCdypyiw%3D%3D
U2 = STM32F405RGT6: as U2 on sheet Sheet1; Package: LQFP-64 STMicroelectronics; Digi-Key_Purchase_URL: https://www.digikey.com/product-detail/en/stmicroelectronics/STM32F405RGT6/497-11767-ND/2754208?utm_source=snapeda&utm_medium=aggregator&utm_campaign=symbol; Value: *; MP: STM32F405RGT6; SnapEDA_Link: https://www.snapeda.com/parts/STM32F405RGT6/STMicroelectronics/view-part/105502/?ref=snap; Digi-Key_Part_Number: 497-11767-ND
Y1 = CSTCE8M00G52-R0: 8MHz Ceramic Resonator Built in Capacitor 10pF Â±0.2% -20Â°C ~ 80Â°C Surface Mount; MF: Murata; Price: None; Check_prices: https://www.snapeda.com/parts/CSTCE8M00G52-R0/Murata%20Electronics%20North%20America/view-part/234504/?ref=eda; SnapEDA_Link: https://www.snapeda.com/parts/CSTCE8M00G52-R0/Murata%20Electronics%20North%20America/view-part/234504/?ref=snap; Package: Surface Mount Murata Electronics North America; Availability: Bad; MP: CSTCE8M00G52-R0; Value: *

## Sheet blockdiagram.SchDoc
size A3
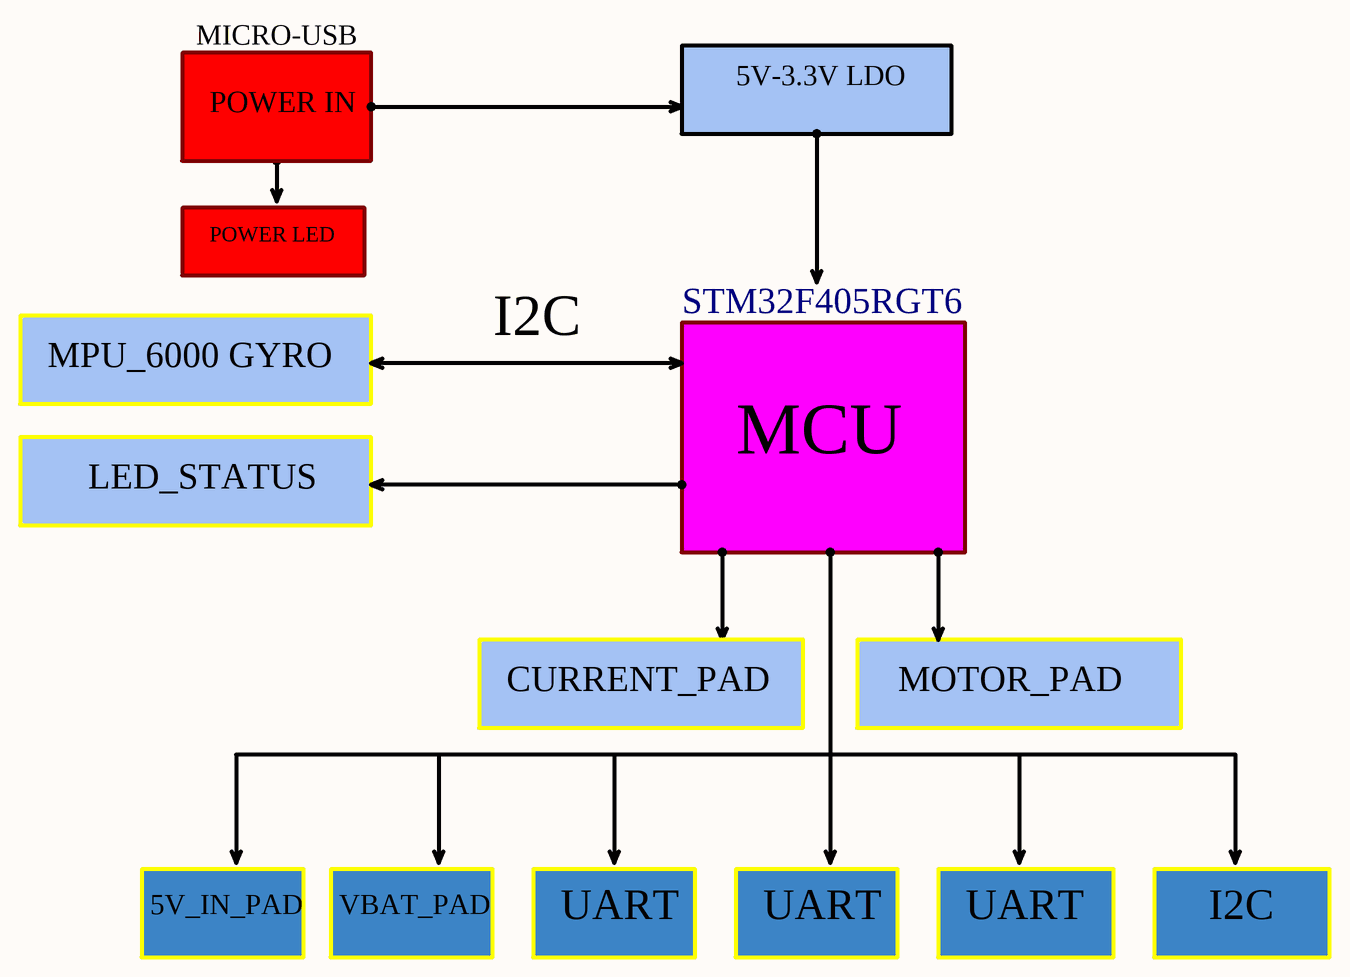
[diagram p2: blockdiagram.SchDoc]

### Notes on the sheet
- MICRO-USB
- POWER IN
- 5V-3.3V LDO
- POWER LED
- STM32F405RGT6
- MPU_6000 GYRO
- I2C
- MCU
- LED_STATUS
- CURRENT_PAD
- MOTOR_PAD
- 5V_IN_PAD
- VBAT_PAD
- UART

## Nets that join several sheets
+3.3V: Sheet1 (24 pins), Sheet2 (5 pins)
+5V_USB: Sheet1 (D2.2 D3.1 J1.1), Sheet2 (R12.2)
GND: Sheet1 (34 pins), Sheet2 (5 pins)
D+: Sheet1 (R2.1 R3.1), Sheet2 (U2.45)
D-: Sheet1 (R1.1), Sheet2 (U2.44)
GYRO_CS: Sheet1 (U3.8), Sheet2 (R9.1 U2.20)
GYRO_INT: Sheet1 (U3.12), Sheet2 (U2.24)
GYRO_SCL: Sheet1 (U3.23), Sheet2 (R10.1 U2.21)
GYRO_SDA: Sheet1 (U3.24), Sheet2 (R11.1 U2.23)
GYRO_SDO: Sheet1 (U3.9), Sheet2 (U2.22)
LED_1: Sheet1 (R6.2), Sheet2 (U2.56)
LED_2: Sheet1 (R7.2), Sheet2 (U2.57)
UART1_RX: Sheet1 (Q1.3 R4.1), Sheet2 (U2.43)